# Altium schematic sheet EEPROM.SchDoc
size A4
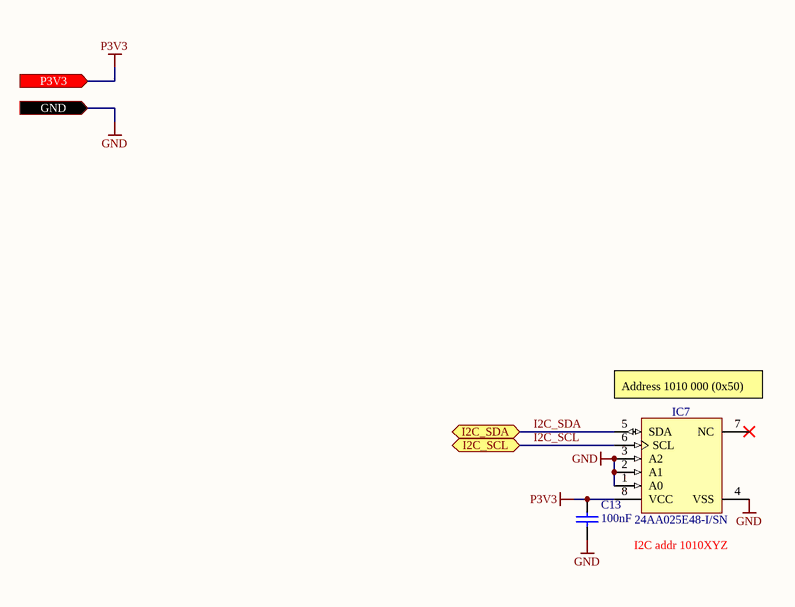
[diagram p0: EEPROM.SchDoc]

## Parts
C13  100nF  [CAPC1608X87N]
IC7  24AA025E48-I/SN  [SOIC127P600X175-8N]

## Ports
GND (in), I2C_SCL (bidir), I2C_SDA (bidir), P3V3 (in)

## Nets
GND: C13.2 IC7.1(A0) IC7.2(A1) IC7.3(A2) IC7.4(VSS) ; port GND
P3V3: C13.1 IC7.8(VCC) ; port P3V3
I2C_SCL: IC7.6(SCL) ; port I2C_SCL
I2C_SDA: IC7.5(SDA) ; port I2C_SDA

Not connected (* = marked no-connect by the designer): IC7 7(NC)*

## Notes on the sheet
- (near IC7) Address 1010 000 (0x50)
- I2C addr 1010XYZ

## Library data of the parts
C13 = CC0603_100NF_50V_10%_X5R: Non-polarised capacitor; Part Description: SMD Multilayer Chip Ceramic Capacitor; Manufacturer: GENERIC; Manufacturer1 Part Number: C1608X5R1H104K080; Voltage: 50V; TC: X5R; Tolerance: ±10%; Part Number: CC0603_100NF_50V_10%_X5R; Component Kind: Standard; Component Type: Standard; Pin Count: 2; Value: 100nF; Status: None; Manufacturer Part Number: CC0603_100NF_50V_10%_X5R; Case: 0603; Mounted: Yes; Socket: No; SMD: Yes; Sense: No; Manufacturer1 Example: TDK; Manufacturer1 ComponentHeight: 0.9mm; HelpURL: \\cern.ch\dfs\Applications\Altium\Datasheets\CC0603_X5R_TDK_C.pdf; Author: CERN DEM MR; CreateDate: 08.01.2016; LatestRevisionDate: 08.01.2016
IC7 = 24AA025E48-I/SN: 1.7V-5.5V, 2K I2C™ Serial EEPROMs with EUI-48™ Node Identity; Manufacturer: MICROCHIP TECHNOLOGY; PressFit: No; Bonding: No; Part Number: 24AA025E48-I/SN; Component Kind: Standard; Component Type: Standard; Device: 24AA025E48-I/SN; PackageDescription: SOIC 8, Pitch 1.27mm - Body 4x5mm, IPC Medium Density; Part Description: 1.7V-5.5V, 2K I2C™ Serial EEPROMs with EUI-48™ Node Identity; Manufacturer Part Number: 24AA025E48-I/SN; Pin Count: 8; Case: SOIC8; Mounted: Yes; Socket: No; SMD: Yes; Sense: No; ComponentHeight: 1.75mm; HelpURL: \\cern.ch\dfs\Applications\Altium\Datasheets\24AA025E48-I-SN.pdf; Author: CERN DEM MR; CreateDate: 19.07.2016; LatestRevisionDate: 19.07.2016